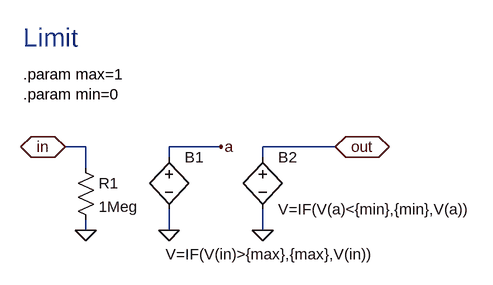
[diagram p0: schematic LIMIT.asc]
LIMIT.asc, the LTspice schematic file:
Version 4
SHEET 1 880 680
WIRE 16 64 -16 64
WIRE 224 64 144 64
WIRE 400 64 288 64
WIRE 144 80 144 64
WIRE 288 80 288 64
WIRE 16 96 16 64
WIRE 16 192 16 176
WIRE 144 192 144 160
WIRE 288 192 288 160
FLAG 144 192 0
FLAG 288 192 0
FLAG 224 64 a
FLAG -16 64 in
IOPIN -16 64 BiDir
FLAG 400 64 out
IOPIN 400 64 BiDir
FLAG 16 192 0
SYMBOL bv 144 64 R0
WINDOW 3 -5 165 Left 2
SYMATTR Value V=IF(V(in)>{max},{max},V(in))
SYMATTR InstName B1
SYMBOL bv 288 64 R0
SYMATTR InstName B2
SYMATTR Value V=IF(V(a)<{min},{min},V(a))
SYMBOL res 0 80 R0
SYMATTR InstName R1
SYMATTR Value 1Meg
TEXT -80 -48 Left 2 !.param max=1\n.param min=0
TEXT -80 -104 Left 4 ;Limit

The netlist it stands for:
* LIMIT.asc
B1 a 0 V=IF(V(in)>{max},{max},V(in))
B2 out 0 V=IF(V(a)<{min},{min},V(a))
R1 in 0 1Meg
.param max=1
.param min=0
* Limit
.backanno
.end